# Altium project Dash Board.PrjPcb
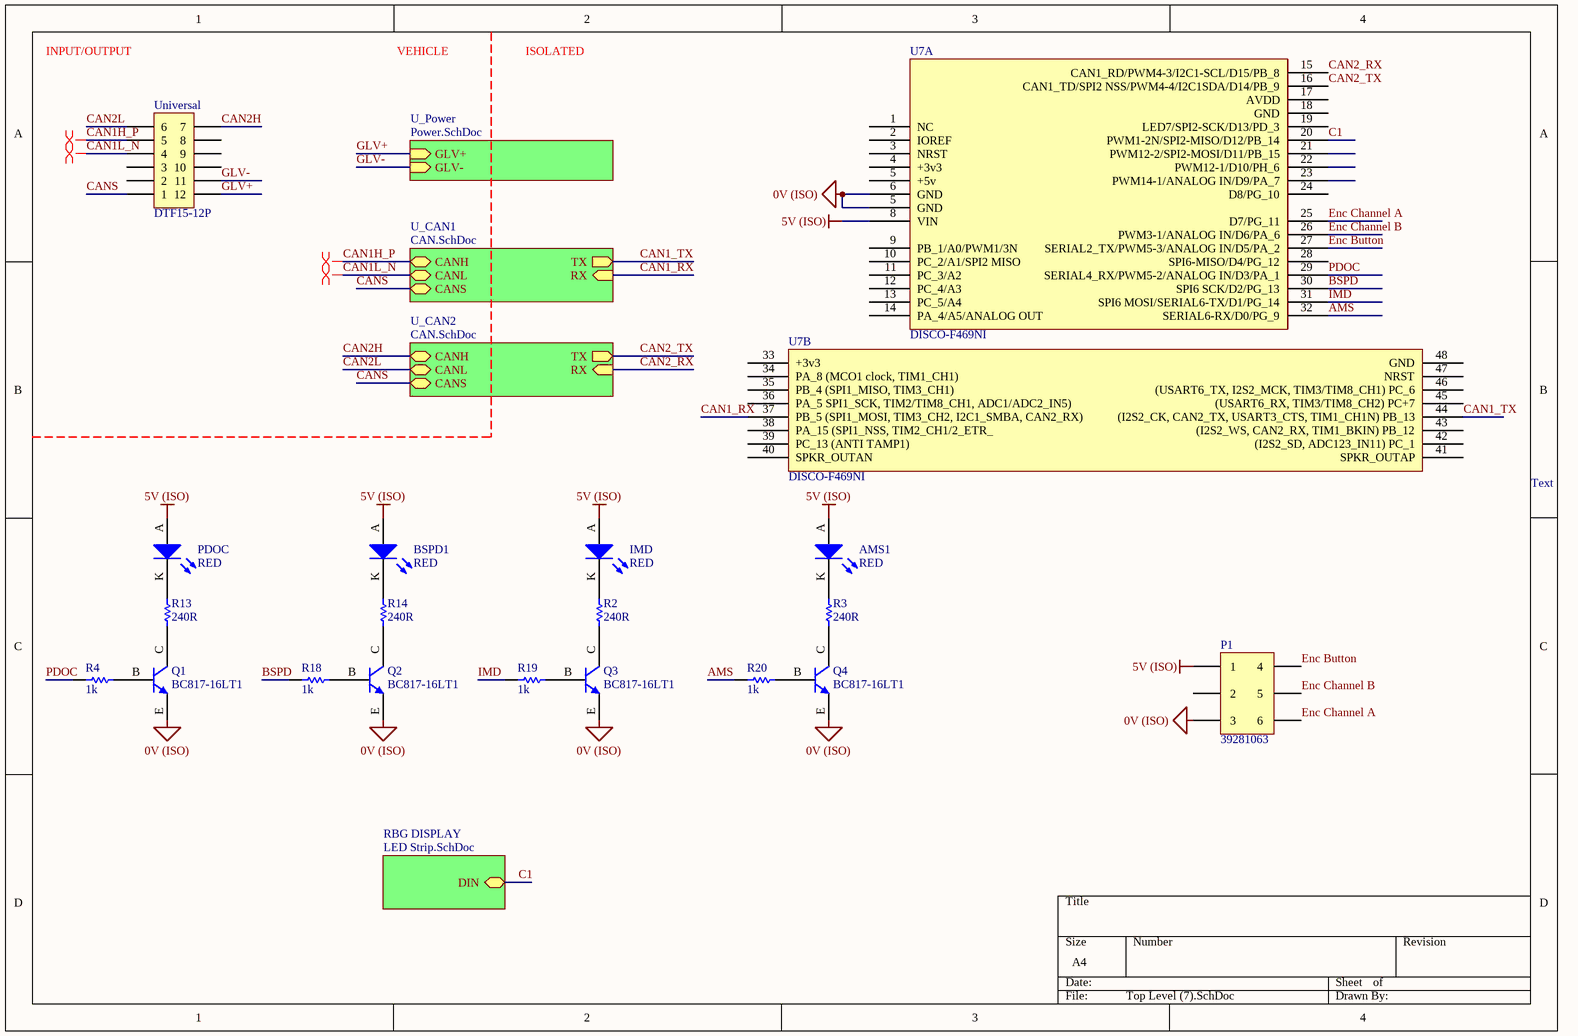
[diagram p0: Top Level (7).SchDoc]
4 sheets, 92 parts. Net scope: hierarchical (ports join the sheet entries above them; power ports are global).
Board file: Dash Board (1).PcbDoc
Sheets:
  Top Level (7).SchDoc
    U_CAN2 = CAN.SchDoc
    U_Power = Power.SchDoc
    U_CAN1 = CAN.SchDoc
    RBG DISPLAY = LED Strip.SchDoc

## Sheet Top Level (7).SchDoc
size A4; SheetNumber: 1; SheetTotal: 4

### Parts
AMS1  RED  [5MM LED]
BSPD1  RED  [5MM LED]
IMD  RED  [5MM LED]
P1  39281063  [39281063]
PDOC  RED  [5MM LED]
Q1  BC817-16LT1  [ON SOT-23 BJT]
Q2  BC817-16LT1  [ON SOT-23 BJT]
Q3  BC817-16LT1  [ON SOT-23 BJT]
Q4  BC817-16LT1  [ON SOT-23 BJT]
R2  240R  [0805]
R3  240R  [0805]
R4  1k  [0805]
R13  240R  [0805]
R14  240R  [0805]
R18  1k  [0805]
R19  1k  [0805]
R20  1k  [0805]
U7  DISCO-F469NI  [DISCO-F469NI]  (parts A,B of 2)
Universal  DTF15-12P  [DTF15-12P]

### Sub-sheets
RBG DISPLAY = LED Strip.SchDoc: DIN (bidir)
U_CAN1 = CAN.SchDoc: CANH (bidir), CANL (bidir), CANS (bidir), RX (in), TX (out)
U_CAN2 = CAN.SchDoc: CANH (bidir), CANL (bidir), CANS (bidir), RX (in), TX (out)
U_Power = Power.SchDoc: GLV+ (in), GLV- (in)

### Nets
0V (ISO): P1.3 Q1.E Q2.E Q3.E Q4.E U7.5(GND) U7.6(GND)
5V (ISO): AMS1.A BSPD1.A IMD.A P1.1 PDOC.A U7.8(VIN)
AMS: R20.1 U7.32(SERIAL6-RX/D0/PG_9)
BSPD: R18.1 U7.30(SPI6_SCK/D2/PG_13)
C1: U7.20(PWM1-2N/SPI2-MISO/D12/PB_14) ; sheet RBG DISPLAY/DIN
CAN1_RX: U7.37(PB_5_(SPI1_MOSI,_TIM3_CH2,_I2C1_SMBA,_CAN2_RX)) ; sheet U_CAN1/RX
CAN1_TX: U7.44((I2S2_CK,_CAN2_TX,_USART3_CTS,_TIM1_CH1N)_PB_13) ; sheet U_CAN1/TX
CAN1H_P: Universal.5 ; sheet U_CAN1/CANH
CAN1L_N: Universal.4 ; sheet U_CAN1/CANL
CAN2_RX: U7.15(CAN1_RD/PWM4-3/I2C1-SCL/D15/PB_8) ; sheet U_CAN2/RX
CAN2_TX: U7.16(CAN1_TD/SPI2_NSS/PWM4-4/I2C1SDA/D14/PB_9) ; sheet U_CAN2/TX
CAN2H: Universal.7 ; sheet U_CAN2/CANH
CAN2L: Universal.6 ; sheet U_CAN2/CANL
CANS: Universal.1 ; sheet U_CAN2/CANS, sheet U_CAN1/CANS
Enc Button: P1.4 U7.27(SERIAL2_TX/PWM5-3/ANALOG_IN/D5/PA_2)
Enc Channel A: P1.6 U7.25(D7/PG_11)
Enc Channel B: P1.5 U7.26(PWM3-1/ANALOG_IN/D6/PA_6)
GLV+: Universal.12 ; sheet U_Power/GLV+
GLV-: Universal.11 ; sheet U_Power/GLV-
IMD: R19.1 U7.31(SPI6_MOSI/SERIAL6-TX/D1/PG_14)
PDOC: R4.1 U7.29(SERIAL4_RX/PWM5-2/ANALOG_IN/D3/PA_1)
NetAMS1_K: AMS1.K R3.2
NetBSPD1_K: BSPD1.K R14.2
NetIMD_K: IMD.K R2.2
NetPDOC_K: PDOC.K R13.2
NetQ1_B: Q1.B R4.2
NetQ1_C: Q1.C R13.1
NetQ2_B: Q2.B R18.2
NetQ2_C: Q2.C R14.1
NetQ3_B: Q3.B R19.2
NetQ3_C: Q3.C R2.1
NetQ4_B: Q4.B R20.2
NetQ4_C: Q4.C R3.1

Not connected (* = marked no-connect by the designer): P1 2; U7 1(NC) 2(IOREF) 3(NRST) 4(+3v3) 9(PB_1/A0/PWM1/3N) 10(PC_2/A1/SPI2_MISO) 11(PC_3/A2) 12(PC_4/A3) 13(PC_5/A4) 14(PA_4/A5/ANALOG_OUT) 17(AVDD) 18(GND) 19(LED7/SPI2-SCK/D13/PD_3) 21(PWM12-2/SPI2-MOSI/D11/PB_15) 22(PWM12-1/D10/PH_6) 23(PWM14-1/ANALOG_IN/D9/PA_7) 24(D8/PG_10) 28(SPI6-MISO/D4/PG_12) 33(+3v3) 34(PA_8_(MCO1_clock,_TIM1_CH1)) 35(PB_4_(SPI1_MISO,_TIM3_CH1)) 36(PA_5_SPI1_SCK,_TIM2/TIM8_CH1,_ADC1/ADC2_IN5)) 38(PA_15_(SPI1_NSS,_TIM2_CH1/2_ETR_) 39(PC_13_(ANTI_TAMP1)) 40(SPKR_OUTAN) 41(SPKR_OUTAP) 42((I2S2_SD,_ADC123_IN11)_PC_1) 43((I2S2_WS,_CAN2_RX,_TIM1_BKIN)_PB_12) 45((USART6_RX,_TIM3/TIM8_CH2)_PC+7) 46((USART6_TX,_I2S2_MCK,_TIM3/TIM8_CH1)_PC_6) 47(NRST) 48(GND); Universal 2 3 8 9 10

### Layout directives
differential pair: CAN1H_P, CAN1L_N

### Notes on the sheet
- INPUT/OUTPUT
- VEHICLE
- ISOLATED
- Text

### Library data of the parts
AMS1 BSPD1 IMD PDOC = C503B-GAN-CB0F0791: LED RED CLEAR 5MM ROUND T/H; Manufacturer: Cree Inc.; Part Number: C503B-GAN-CB0F0791; Colour: Green; Digikey Part Number: C503B-GAN-CB0F0791-ND; Digikey Link: https://www.digikey.com/products/en?mpart=C503B-GAN-CB0F0791&v=90&fbclid=IwAR2JUDlssEKQKztQKB3h34IlXIXn-Voov26K1DpWHwQ6mgzekaFZMifRLJU
P1 = 39281063: Mini-Fit VERT 3x2; Positions: 6; Pitch: 4.20mm; Row Spacing: 4.2mm; Angle: 0; Flange: No; Contact: Gold; Part Number: 39281063; Digikey Part Number: WM3802-ND; Digikey Link: https://www.digikey.com/product-detail/en/molex/0039281063/WM3802-ND/61404
Q1-Q4 = BC817-16LT1: 300mW  BJT NPN Transistor; Manufacturer: ON Semiconductor; Part Number: BC817-16LT1; Digikey Part Number: BC817-16LT1OSTR-ND; Digikey Link: https://www.digikey.com.au/product-detail/en/on-semiconductor/BC817-16LT1/BC817-16LT1OSTR-ND/606178
R2 R3 R13 R14 = RC0805FR07240RL: Manufacturer: YAGEO; Tolerance: 0.01; Rated Voltage: 0.125W; Part Number: RC0805FR07240RL; Value: 240R; Material: FR-07; qty: 50
R4 R18-R20 = RC0805FR071KL: Manufacturer: YAGEO; Tolerance: 0.01; Rated Voltage: 0.125W; Part Number: RC0805FR071KL; Value: 1k; Material: FR-07; qty: 50
U7 = DISCO-F469NI: STM32F469 Discovery STM32F4 ARM® Cortex®-M4 MCU 32-Bit Embedded Evaluation Board  (The Disco 69 lol); Manufacturer: STMicroelectronics; Part Number: DISCO-F469NI; Digikey Part Number: 497-15990-ND; Digikey Link: https://www.digikey.com/product-detail/en/stmicroelectronics/STM32F469I-DISCO/497-15990-ND/5428811
Universal = DTF15-12P[[/\]]DTF15-12P: Positions: 12; Pitch: 4.44mm; Row Spacing: 9.12 mm; Angle: 0; Flange: No; Contact: Copper Alloy; Part Number: DTF15-12P; Digikey Part Number: 1734-1647-ND; Digikey Link: https://www.digikey.com.au/product-detail/en/te-connectivity-deutsch-connectors/DTF15-12PA/1734-1647-ND/7220164

## Sheet CAN.SchDoc
size A4; SheetNumber: 2; SheetTotal: 4
Used 2 times, as channels U_CAN2, U_CAN1. Parts and nets are listed once, with the designators drawn on the sheet.
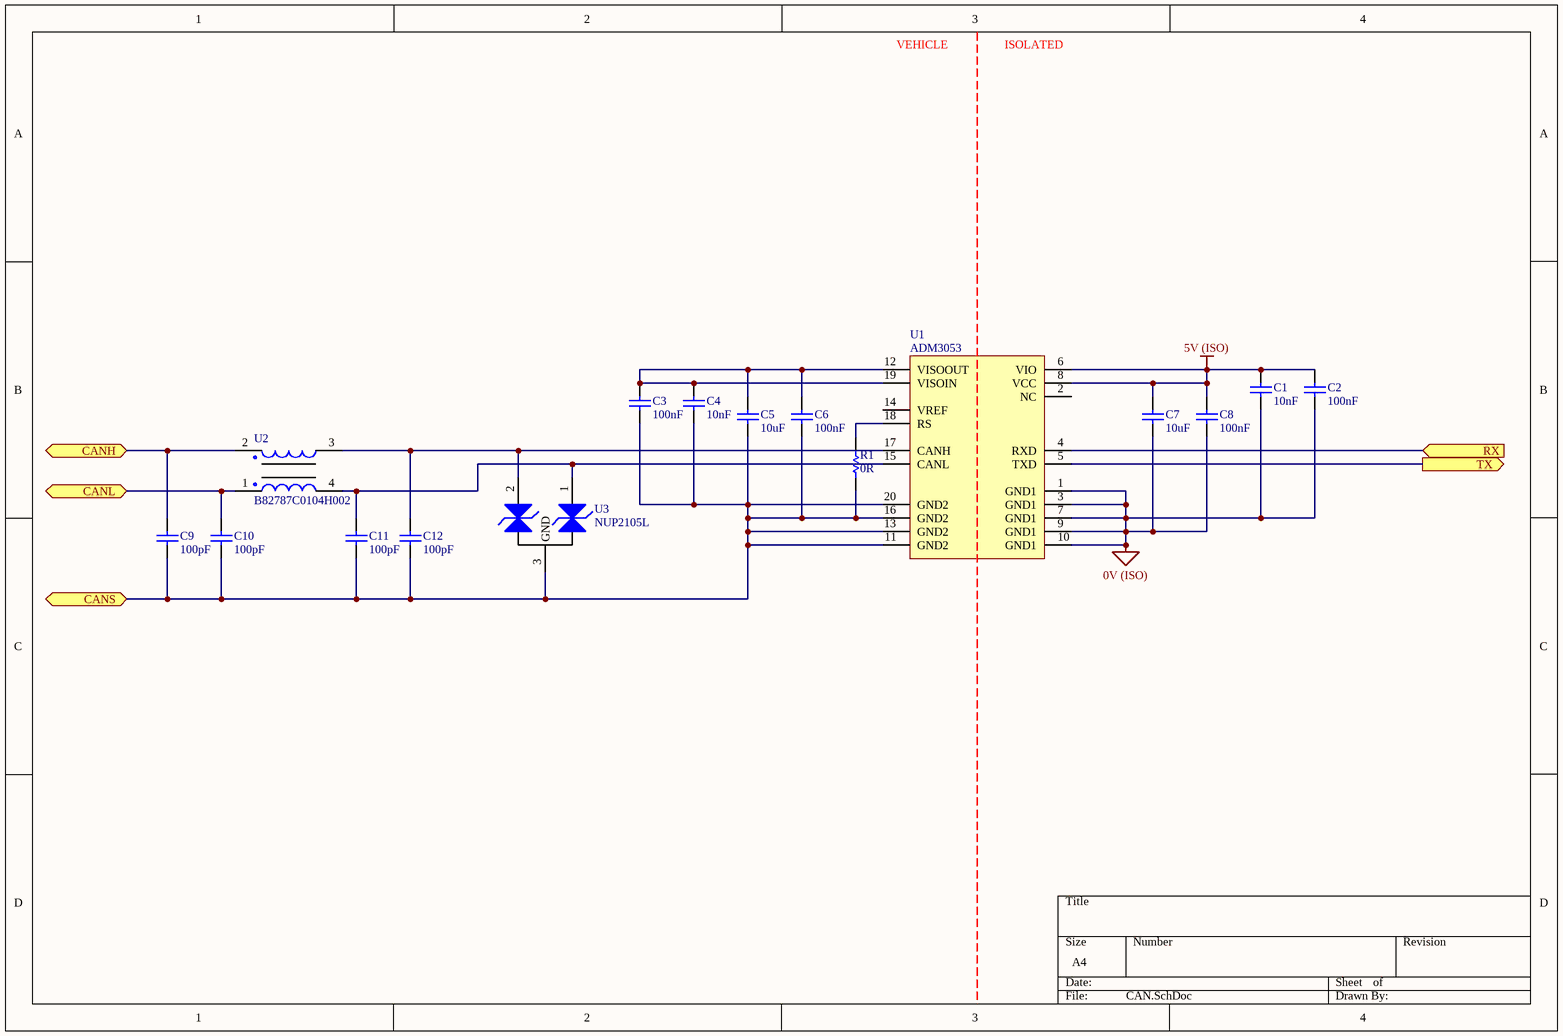
[diagram p1: CAN.SchDoc]

### Parts
C1  10nF  [1206]
C2  100nF  [0805]
C3  100nF  [0805]
C4  10nF  [1206]
C5  10uF  [0805]
C6  100nF  [0805]
C7  10uF  [0805]
C8  100nF  [0805]
C9  100pF  [0805]
C10  100pF  [0805]
C11  100pF  [0805]
C12  100pF  [0805]
R1  0R  [0805]
U1  ADM3053  [AD SOIC-W 20]
U2  B82787C0104H002  [TDK 4-PC Pad]
U3  NUP2105L  [ON SOT-23]

### Ports
CANH (bidir), CANL (bidir), CANS (bidir), RX (in), TX (out)

### Nets
0V (ISO): C1.1 C2.1 C7.1 C8.1 U1.1(GND1) U1.3(GND1) U1.7(GND1) U1.9(GND1) U1.10(GND1)
5V (ISO): C1.2 C2.2 C7.2 C8.2 U1.6(VIO) U1.8(VCC)
CANH: C9.2 U2.2 ; port CANH
CANL: C10.2 U2.1 ; port CANL
CANS: C3.1 C4.1 C5.1 C6.1 C9.1 C10.1 C11.1 C12.1 R1.1 U1.11(GND2) U1.13(GND2) U1.16(GND2) U1.20(GND2) U3.3(GND) ; port CANS
RX: U1.4(RXD) ; port RX
TX: U1.5(TXD) ; port TX
NetC3_2: C3.2 C4.2 C5.2 C6.2 U1.12(VISOOUT) U1.19(VISOIN)
NetC11_2: C11.2 U1.15(CANL) U2.4 U3.1(CAN_H)
NetC12_2: C12.2 U1.17(CANH) U2.3 U3.2(CAN_L)
NetR1_2: R1.2 U1.18(RS)

Not connected (* = marked no-connect by the designer): U1 2(NC) 14(VREF)

### Channels
U_CAN2: designators end in _U_CAN2; ports CANH=CAN2H CANL=CAN2L CANS=CANS RX=CAN2_RX TX=CAN2_TX
U_CAN1: designators end in _U_CAN1; ports CANH=CAN1H_P CANL=CAN1L_N CANS=CANS RX=CAN1_RX TX=CAN1_TX

### Notes on the sheet
- VEHICLE
- ISOLATED

### Library data of the parts
C1 C4 = GCM3195C2A103JA16D: Manufacturer: muRata; Tolerance: 5%; Material: Ceramic; Rated Voltage: 100V; Part Number: GCM3195C2A103JA16D; Value: 10nF; Digikey Part Number: 490-4978-2-ND
C2 C3 C6 C8 = GCM21BR71E104KA37L: Manufacturer: muRata; Tolerance: 10%; Material: X7R; Rated Voltage: 25V; Part Number: GCM21BR71E104KA37L; Value: 100nF
C5 C7 = GRM21BR6YA106KE43L: Manufacturer: muRata; Tolerance: 10%; Material: X5R; Rated Voltage: 50V; Part Number: GRM21BR6YA106KE43L; Value: 10uF; Digikey Part Number: 490-10514-6-ND
C9-C12 = GCM21B5C1H101JA37L: Manufacturer: muRata; Tolerance: 5%; Material: C0G; Rated Voltage: 50V; Part Number: GCM21B5C1H101JA37L; Value: 100pF
R1 = RC0805FR070RL: Manufacturer: YAGEO; Tolerance: 0.01; Rated Voltage: 0.125W; Value: 0R; Part Number: RC0805FR070RL; Material: FR-07; qty: 50
U1 = ADM3053: Isolated CAN Transceiver; Manufacturer: Analogue Devices; Part Number: ADM3053; Digikey Part Number: ADM3053BRWZ-ND; Digikey Link: https://www.digikey.com/product-detail/en/analog-devices-inc/ADM3053BRWZ/ADM3053BRWZ-ND/2709332
U2 = B82787C0104H002: Common mode choke intended for CANBUS 150mA 50V); Manufacturer: EPCOS (TDK); Part Number: B82787C0104H002; Digikey Part Number: 495-4598-2-ND; Digikey Link: https://www.digikey.com/product-detail/en/epcos-tdk/B82787C0104H002/495-4598-2-ND/3680998
U3 = NUP2105L: Dual Line CAN Bus Protector; Manufacturer: ON Semiconductor; Part Number: NUP2105L; Digikey Part Number: NUP2105LT1GOSCT-ND; Digikey Link: https://www.digikey.com/product-detail/en/on-semiconductor/NUP2105LT1G/NUP2105LT1GOSCT-ND/1485001

## Sheet Power.SchDoc
size A4; SheetNumber: 4; SheetTotal: 4
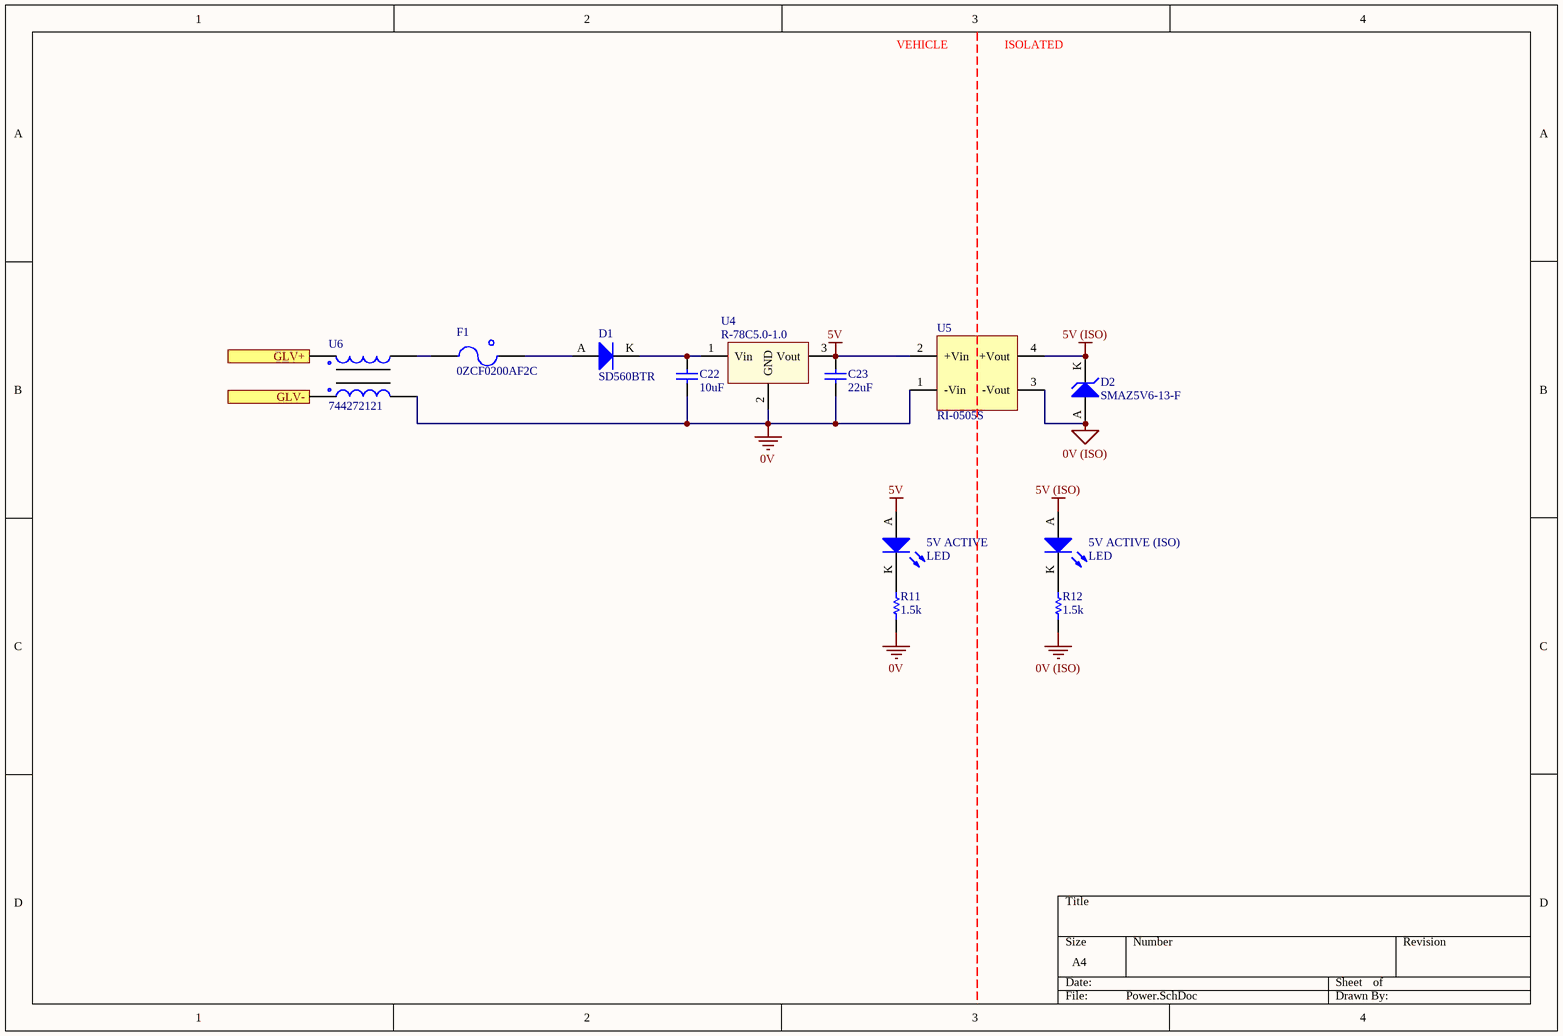
[diagram p2: Power.SchDoc]

### Parts
5V_ACTIVE  LED  [0805 LED]
5V_ACTIVE_(ISO)  LED  [0805 LED]
C22  10uF  [0805]
C23  22uF  [0805]
D1  SD560BTR  [SMB Diode]
D2  SMAZ5V6-13-F  [DI SMA Diode]
F1  0ZCF0200AF2C  [2920]
R11  1.5k  [0805]
R12  1.5k  [0805]
U4  R-78C5.0-1.0  [RECOM 3-SIP]
U5  RI-0505S  [RECOM 4-SIP]
U6  744272121  [Wurth 4-PC Pad]

### Ports
GLV+ (in), GLV- (in)

### Nets
0V: C22.1 C23.1 R11.1 U4.2(GND) U5.1(-Vin) U6.3
0V (ISO): D2.A R12.1 U5.3(-Vout)
5V: 5V_ACTIVE.A C23.2 U4.3(Vout) U5.2(+Vin)
5V (ISO): 5V_ACTIVE_(ISO).A D2.K U5.4(+Vout)
GLV+: U6.1 ; port GLV+
GLV-: U6.4 ; port GLV-
Net5V_ACTIVE_(ISO)_K: 5V_ACTIVE_(ISO).K R12.2
Net5V_ACTIVE_K: 5V_ACTIVE.K R11.2
NetC22_2: C22.2 D1.K U4.1(Vin)
NetD1_A: D1.A F1.2
NetF1_1: F1.1 U6.2

### Notes on the sheet
- VEHICLE
- ISOLATED

### Library data of the parts
5V_ACTIVE 5V_ACTIVE_(ISO) = SML-210LTT86: Red LED Indication - Discrete 1.75V 0805 (2012 Metric); Manufacturer: ROHM Semiconductor; Part Number: SML-210LTT86; Colour: Red; Digikey Part Number: 511-1286-1-ND; Digikey Link: https://www.digikey.com/product-detail/en/rohm-semiconductor/SML-210LTT86/511-1286-1-ND/637099
C22 = GRM21BR6YA106KE43L: as C5 on sheet CAN; Value: 10uF; Digikey Part Number: 490-10514-6-ND; Part Number: GRM21BR6YA106KE43L
C23 = GRM21BR61A226ME51L: Manufacturer: muRata; Tolerance: 20%; Material: X5R; Rated Voltage: 10V; Value: 22uF; Digikey Part Number: 490-10511-1-ND; Part Number: GRM21BR61A226ME51L
D1 = SD560BTR: 1.2V_F 600V 5A SMB; Manufacturer: SMC Diode Solutions; Part Number: SD560BTR; Digikey Part Number: 1655-1530-2-ND; Digikey Link: https://www.digikey.com/product-detail/en/smc-diode-solutions/SD560BTR/1655-1530-2-ND/6022620
D2 = SMAZ5V6-13-F: DIODE ZENER 5.6V 1W SMA; Manufacturer: Diodes Inc; Part Number: SMAZ5V6-13-F; Digikey Part Number: SMAZ5V6-FDICT-ND; Digikey Link: https://www.digikey.com/product-detail/en/diodes-incorporated/SMAZ5V6-13-F/SMAZ5V6-FDICT-ND/755500
F1 = 0ZCF0200AF2C: SMD 24V 2A Fuse; Manufacturer: Bel Fuse Inc; Part Number: 0ZCF0200AF2C; Digikey Part Number: 507-1749-2-ND; Digikey Link: https://www.digikey.com/product-detail/en/bel-fuse-inc/0ZCF0200AF2C/507-1749-2-ND/4156090
R11 R12 = RC0805FR071K5L: Manufacturer: YAGEO; Tolerance: 0.01; Rated Voltage: 0.125W; Part Number: RC0805FR071K5L; Value: 1.5k; Material: FR-07; qty: 50
U4 = R-78C5.0-1.0: CONV DC/DC 1A 5V OUT SIP VERT; Manufacturer: Recom; Part Number: R-78C5.0-1.0; Digikey Part Number: 945-1395-5-ND; Digikey Link: https://www.digikey.com.au/product-detail/en/recom-power/R-78C5.0-1.0/945-1395-5-ND/2652148
U5 = RI-0505S: 5V DC-DC Converter (2W); Manufacturer: Recom; Part Number: RI-0505S; Digikey Part Number: 945-1189-ND; Digikey Link: https://www.digikey.com/product-detail/en/recom-power/RI-0505S/945-1189-ND/2256369
U6 = 744272121: Common Mode Choke 120UH 2.5A 2LN 460 OHM SMD; Manufacturer: Wurth Electronics Inc; Part Number: 744272121; Digikey Part Number: 732-1489-2-ND; Digikey Link: https://www.digikey.com/product-detail/en/wurth-electronics-inc/744272121/732-1489-2-ND/1638893

## Sheet LED Strip.SchDoc
size A4; SheetNumber: 3; SheetTotal: 4
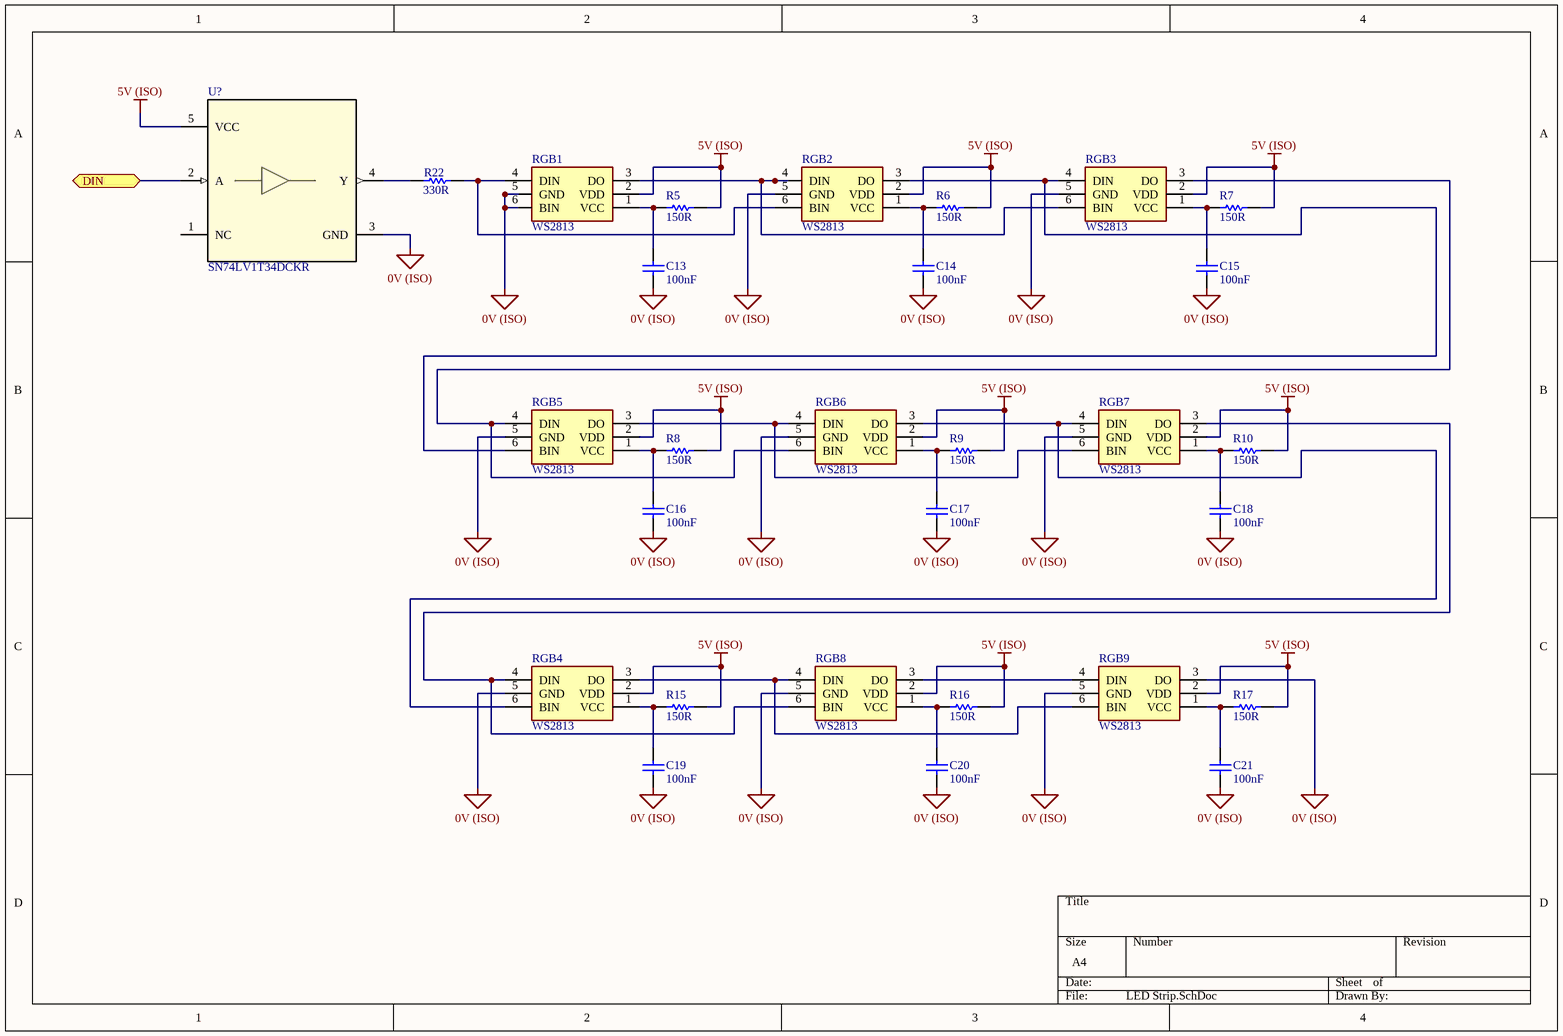
[diagram p3: LED Strip.SchDoc]

### Parts
C13  100nF  [0805]
C14  100nF  [0805]
C15  100nF  [0805]
C16  100nF  [0805]
C17  100nF  [0805]
C18  100nF  [0805]
C19  100nF  [0805]
C20  100nF  [0805]
C21  100nF  [0805]
R5  150R  [0805]
R6  150R  [0805]
R7  150R  [0805]
R8  150R  [0805]
R9  150R  [0805]
R10  150R  [0805]
R15  150R  [0805]
R16  150R  [0805]
R17  150R  [0805]
R22  330R  [0805]
RGB1  WS2813  [WS2812]
RGB2  WS2813  [WS2812]
RGB3  WS2813  [WS2812]
RGB4  WS2813  [WS2812]
RGB5  WS2813  [WS2812]
RGB6  WS2813  [WS2812]
RGB7  WS2813  [WS2812]
RGB8  WS2813  [WS2812]
RGB9  WS2813  [WS2812]
U?  SN74LV1T34DCKR  [DCK0005A_N]

### Ports
DIN (bidir)

### Nets
0V (ISO): C13.1 C14.2 C15.2 C16.2 C17.2 C18.2 C19.2 C20.2 C21.2 RGB1.5(GND) RGB1.6(BIN) RGB2.5(GND) RGB3.5(GND) RGB4.5(GND) RGB5.5(GND) RGB6.5(GND) RGB7.5(GND) RGB8.5(GND) RGB9.3(DO) RGB9.5(GND) U?.3(GND)
5V (ISO): R5.2 R6.2 R7.2 R8.2 R9.2 R10.2 R15.2 R16.2 R17.2 RGB1.2(VDD) RGB2.2(VDD) RGB3.2(VDD) RGB4.2(VDD) RGB5.2(VDD) RGB6.2(VDD) RGB7.2(VDD) RGB8.2(VDD) RGB9.2(VDD) U?.5(VCC)
C1: U?.2(A) ; port DIN
NetC13_2: C13.2 R5.1 RGB1.1(VCC)
NetC14_1: C14.1 R6.1 RGB2.1(VCC)
NetC15_1: C15.1 R7.1 RGB3.1(VCC)
NetC16_1: C16.1 R8.1 RGB5.1(VCC)
NetC17_1: C17.1 R9.1 RGB6.1(VCC)
NetC18_1: C18.1 R10.1 RGB7.1(VCC)
NetC19_1: C19.1 R15.1 RGB4.1(VCC)
NetC20_1: C20.1 R16.1 RGB8.1(VCC)
NetC21_1: C21.1 R17.1 RGB9.1(VCC)
NetR22_1: R22.1 U?.4(Y)
NetR22_2: R22.2 RGB1.4(DIN) RGB2.6(BIN)
NetRGB1_3: RGB1.3(DO) RGB2.4(DIN) RGB3.6(BIN)
NetRGB2_3: RGB2.3(DO) RGB3.4(DIN) RGB5.6(BIN)
NetRGB3_3: RGB3.3(DO) RGB5.4(DIN) RGB6.6(BIN)
NetRGB4_3: RGB4.3(DO) RGB8.4(DIN) RGB9.6(BIN)
NetRGB4_4: RGB4.4(DIN) RGB7.3(DO) RGB8.6(BIN)
NetRGB4_6: RGB4.6(BIN) RGB6.3(DO) RGB7.4(DIN)
NetRGB5_3: RGB5.3(DO) RGB6.4(DIN) RGB7.6(BIN)
NetRGB8_3: RGB8.3(DO) RGB9.4(DIN)

Not connected (* = marked no-connect by the designer): U? 1(NC)

### Library data of the parts
C13-C21 = GCM21BR71H104KA37L: Manufacturer: muRata; Tolerance: ±10%; Material: X7R; Rated Voltage: 50V; Part Number: GCM21BR71H104KA37L; Value: 100nF; Digikey Part Number: 490-6064-1-ND
R5-R10 R15-R17 = RC0805FR07150RL: Manufacturer: YAGEO; Tolerance: 0.01; Rated Voltage: 0.125W; Part Number: RC0805FR07150RL; Value: 150R; Material: FR-07; Digikey Part Number: 311-150CRCT-ND
R22 = RC0805FR07330RL: Manufacturer: YAGEO; Tolerance: 0.01; Rated Voltage: 0.125W; Part Number: RC0805FR07330RL; Value: 330R; Material: FR-07; Digikey Part Number: 311-330CRCT-ND
RGB1-RGB9 = WS2813: LED; Manufacturer_Name: Worldsemi; Datasheet Link: http://www.tme.eu/gb/Document/cf443473af21167b0bdd177fb1a7e90a/WS2813.pdf; Manufacturer_Part_Number: WS2813
U? = SN74LV1T34DCKR: No Description Available; Manufacturer: Texas Instruments; CompType: IC; PIN_COUNT: 5; SymbolVerison: 2014-09-28; PartNumber: SN74LV1T34DCK; PackageReference: DCK0005A; MountType: SMT; RoHS: Y; RefDes: RefDes; Type: DEV; Value: Value; Copyright: Copyright (C) 2018 Accelerated Designs. All rights reserved

## Nets that join several sheets
0V (ISO): Top Level (7) (7 pins), U_CAN2 (9 pins), Power (D2.A R12.1 U5.3), U_CAN1 (9 pins), LED Strip (21 pins)
5V (ISO): Top Level (7) (6 pins), U_CAN2 (6 pins), Power (5V_ACTIVE_(ISO).A D2.K U5.4), U_CAN1 (6 pins), LED Strip (19 pins)
C1: Top Level (7) (U7.20), LED Strip (U?.2)
CAN1_RX: Top Level (7) (U7.37), U_CAN1 (U1_U_CAN1.4)
CAN1_TX: Top Level (7) (U7.44), U_CAN1 (U1_U_CAN1.5)
CAN1H_P: Top Level (7) (Universal.5), U_CAN1 (C9_U_CAN1.2 U2_U_CAN1.2)
CAN1L_N: Top Level (7) (Universal.4), U_CAN1 (C10_U_CAN1.2 U2_U_CAN1.1)
CAN2_RX: Top Level (7) (U7.15), U_CAN2 (U1_U_CAN2.4)
CAN2_TX: Top Level (7) (U7.16), U_CAN2 (U1_U_CAN2.5)
CAN2H: Top Level (7) (Universal.7), U_CAN2 (C9_U_CAN2.2 U2_U_CAN2.2)
CAN2L: Top Level (7) (Universal.6), U_CAN2 (C10_U_CAN2.2 U2_U_CAN2.1)
CANS: Top Level (7) (Universal.1), U_CAN2 (14 pins), U_CAN1 (14 pins)
GLV+: Top Level (7) (Universal.12), Power (U6.1)
GLV-: Top Level (7) (Universal.11), Power (U6.4)